# Altium schematic sheet PowerPath.SchDoc
size A4
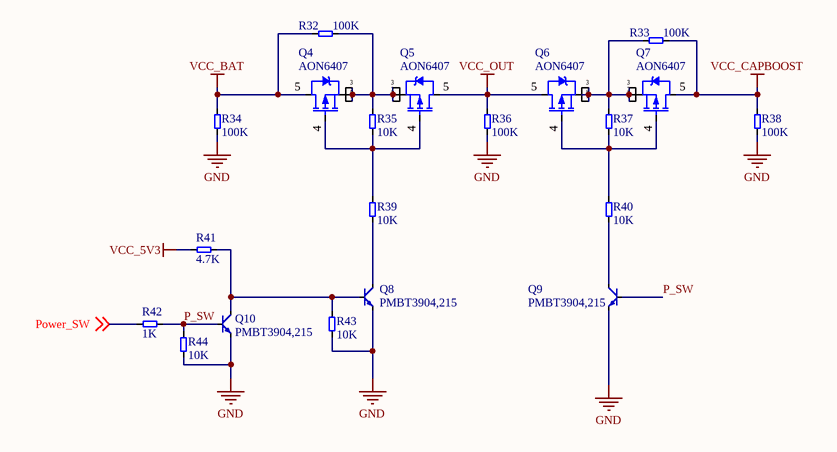
[diagram p0: PowerPath.SchDoc]

## Parts
Q4  AON6407  [DFN5x6]
Q5  AON6407  [DFN5x6]
Q6  AON6407  [DFN5x6]
Q7  AON6407  [DFN5x6]
Q8  PMBT3904,215  [SOT-23-3]
Q9  PMBT3904,215  [SOT-23-3]
Q10  PMBT3904,215  [SOT-23-3]
R32  100K  [R-0603-L]
R33  100K  [R-0603-L]
R34  100K  [R-0603-L]
R35  10K  [R-0603-L]
R36  100K  [R-0603-L]
R37  10K  [R-0603-L]
R38  100K  [R-0603-L]
R39  10K  [R-0603-L]
R40  10K  [R-0603-L]
R41  4.7K  [R-0603-L]
R42  1K  [R-0603-L]
R43  10K  [R-0603-L]
R44  10K  [R-0603-L]

## Nets
GND: Q8.2(E) Q9.2(E) Q10.2(E) R34.1 R36.1 R38.1 R43.2 R44.2
VCC_5V3: R41.2
VCC_BAT: Q4.5(D) R32.2 R34.2
VCC_CAPBOOST: Q7.5(D) R33.1 R38.2
VCC_OUT: Q5.5(D) Q6.5(D) R36.2
P_SW: Q9.1(B) Q10.1(B) R42.2 R44.1
Power_SW: R42.1 ; off-sheet Power_SW
NetQ4_1: Q4.1(S) Q4.2(S) Q4.3(S) Q5.1(S) Q5.2(S) Q5.3(S) R32.1 R35.2
NetQ4_4: Q4.4(G) Q5.4(G) R35.1 R39.2
NetQ6_1: Q6.1(S) Q6.2(S) Q6.3(S) Q7.1(S) Q7.2(S) Q7.3(S) R33.2 R37.2
NetQ6_4: Q6.4(G) Q7.4(G) R37.1 R40.2
NetQ8_1: Q8.1(B) Q10.3(C) R41.1 R43.1
NetQ8_3: Q8.3(C) R39.1
NetQ9_3: Q9.3(C) R40.1

## Library data of the parts
Q4-Q7 = MOS-P_1
Q8-Q10 = BJT_NPN: Transistor
R32-R44 = Res